# EAGLE schematic 上部機構用エンコーダ (EAGLE 9.6.2)
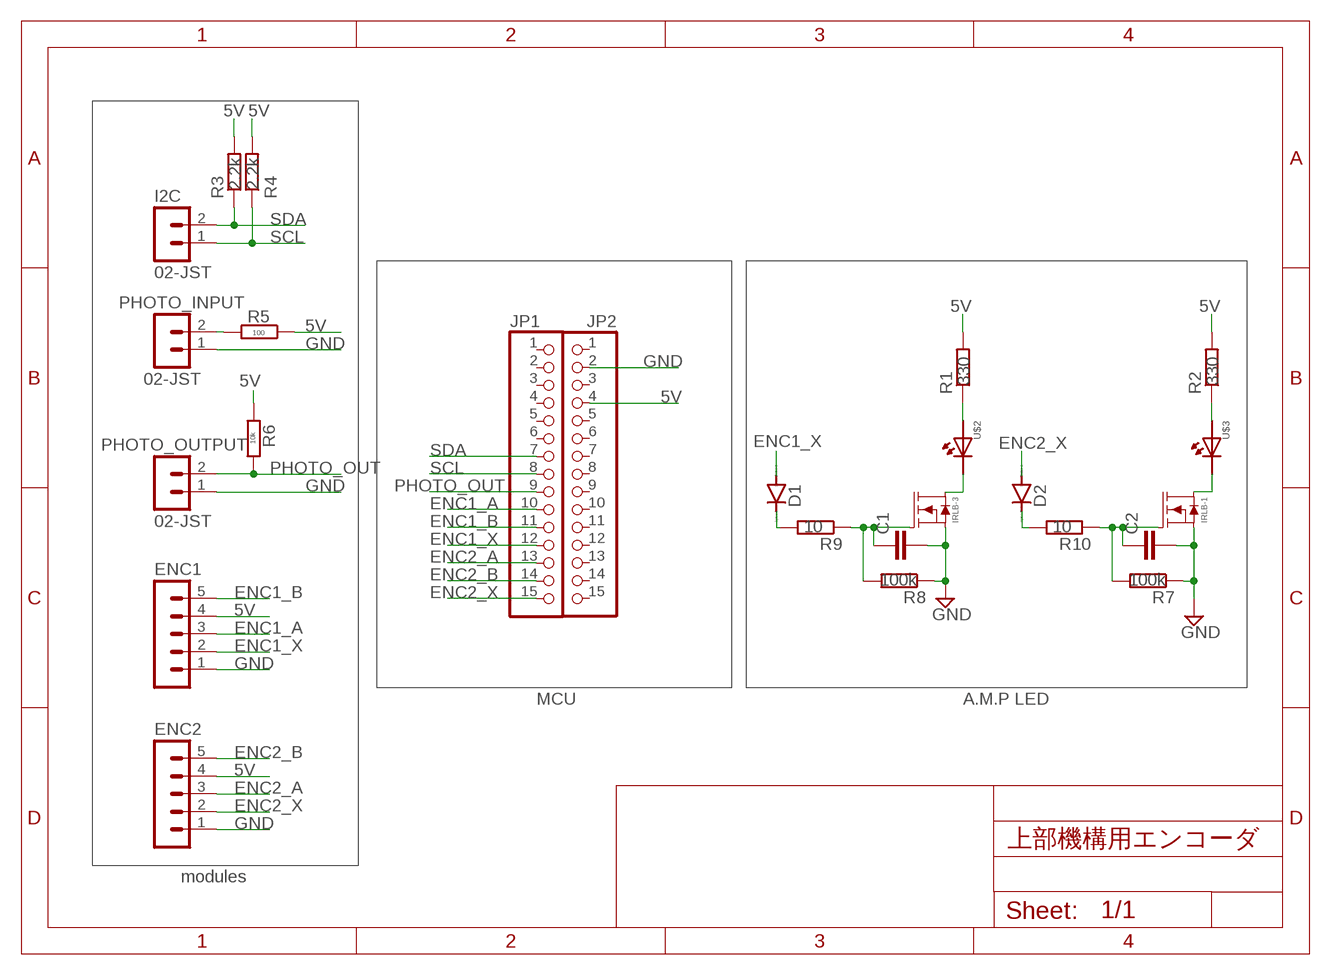
[diagram p0: schematic, sheet 1]

## Parts
C1  C5/2.5  [C5B2.5]
C2  C5/2.5  [C5B2.5]
D1  DIODE_STAND  [DIODE_STAND]
D2  DIODE_STAND  [DIODE_STAND]
ENC1  05-JST  [B5B-XH]
ENC2  05-JST  [B5B-XH]
I2C  02-JST  [B2B-XH]
IRLB-1  IRLB3813STAND  [TO-220AB-STAND]
IRLB-3  IRLB3813STAND  [TO-220AB-STAND]
JP1  PINHD-1X15  [1X15]
JP2  PINHD-1X15  [1X15]
PHOTO_INPUT  02-JST  [B2B-XH]
PHOTO_OUTPUT  02-JST  [B2B-XH]
R1  330  R-EU_0207/2V  [0207/2V]
R2  330  R-EU_0207/2V  [0207/2V]
R3  2.2k  R-EU_0207/2V  [0207/2V]
R4  2.2k  R-EU_0207/2V  [0207/2V]
R5  100  R-EU_0204/7  [0204/7]
R6  10k  R-EU_0204/7  [0204/7]
R7  100k  R-EU_0207/2V  [0207/2V]
R8  100k  R-EU_0207/2V  [0207/2V]
R9  10  R-EU_0207/2V  [0207/2V]
R10  10  R-EU_0207/2V  [0207/2V]
U$2  LED  [LED3MM]
U$3  LED  [LED3MM]

## Nets
5V: ENC1.4 ENC2.4 JP2.4 R1.2 R2.2 R3.2 R4.2 R5.1 R6.2
ENC1_A: ENC1.3 JP1.10
ENC1_B: ENC1.5 JP1.11
ENC1_X: D1.A ENC1.2 JP1.12
ENC2_A: ENC2.3 JP1.13
ENC2_B: ENC2.5 JP1.14
ENC2_X: D2.A ENC2.2 JP1.15
GND: C1.2 C2.2 ENC1.1 ENC2.1 IRLB-1.S IRLB-3.S JP2.2 PHOTO_INPUT.1 PHOTO_OUTPUT.1 R7.1 R8.1
N$1: IRLB-3.D U$2.C
N$2: R1.1 U$2.A
N$3: C1.1 IRLB-3.G R8.2 R9.1
N$4: C2.1 IRLB-1.G R7.2 R10.1
N$5: IRLB-1.D U$3.C
N$6: R2.1 U$3.A
N$7: PHOTO_INPUT.2 R5.2
N$8: D1.C R9.2
N$9: D2.C R10.2
PHOTO_OUT: JP1.9 PHOTO_OUTPUT.2 R6.1
SCL: I2C.1 JP1.8 R4.1
SDA: I2C.2 JP1.7 R3.1
Unconnected: JP1.1 JP1.2 JP1.3 JP1.4 JP1.5 JP1.6 JP2.1 JP2.3 JP2.5 JP2.6 JP2.7 JP2.8 JP2.9 JP2.10 JP2.11 JP2.12 JP2.13 JP2.14 JP2.15

## Notes on the sheet
- MCU | A.M.P LED
- modules

## Library data of the parts
C1 C2 = capacitor-wima:C: CAPACITOR naming: grid - package width
D1 D2 = DIODE_STAND:DIODE_STAND
ENC1 ENC2 = con-jst-xh:05-JST: JST CONNECTOR
I2C PHOTO_INPUT PHOTO_OUTPUT = con-jst-xh:02-JST: JST CONNECTOR
IRLB-1 IRLB-3 = OKUDA_libraries:IRLB3813
JP1 JP2 = pinhead:PINHD-1X15: PIN HEADER
R1-R10 = rcl:R-EU_: RESISTOR, European symbol; SPICEPREFIX: R
U$2 U$3 = OKUDA_libraries:LED